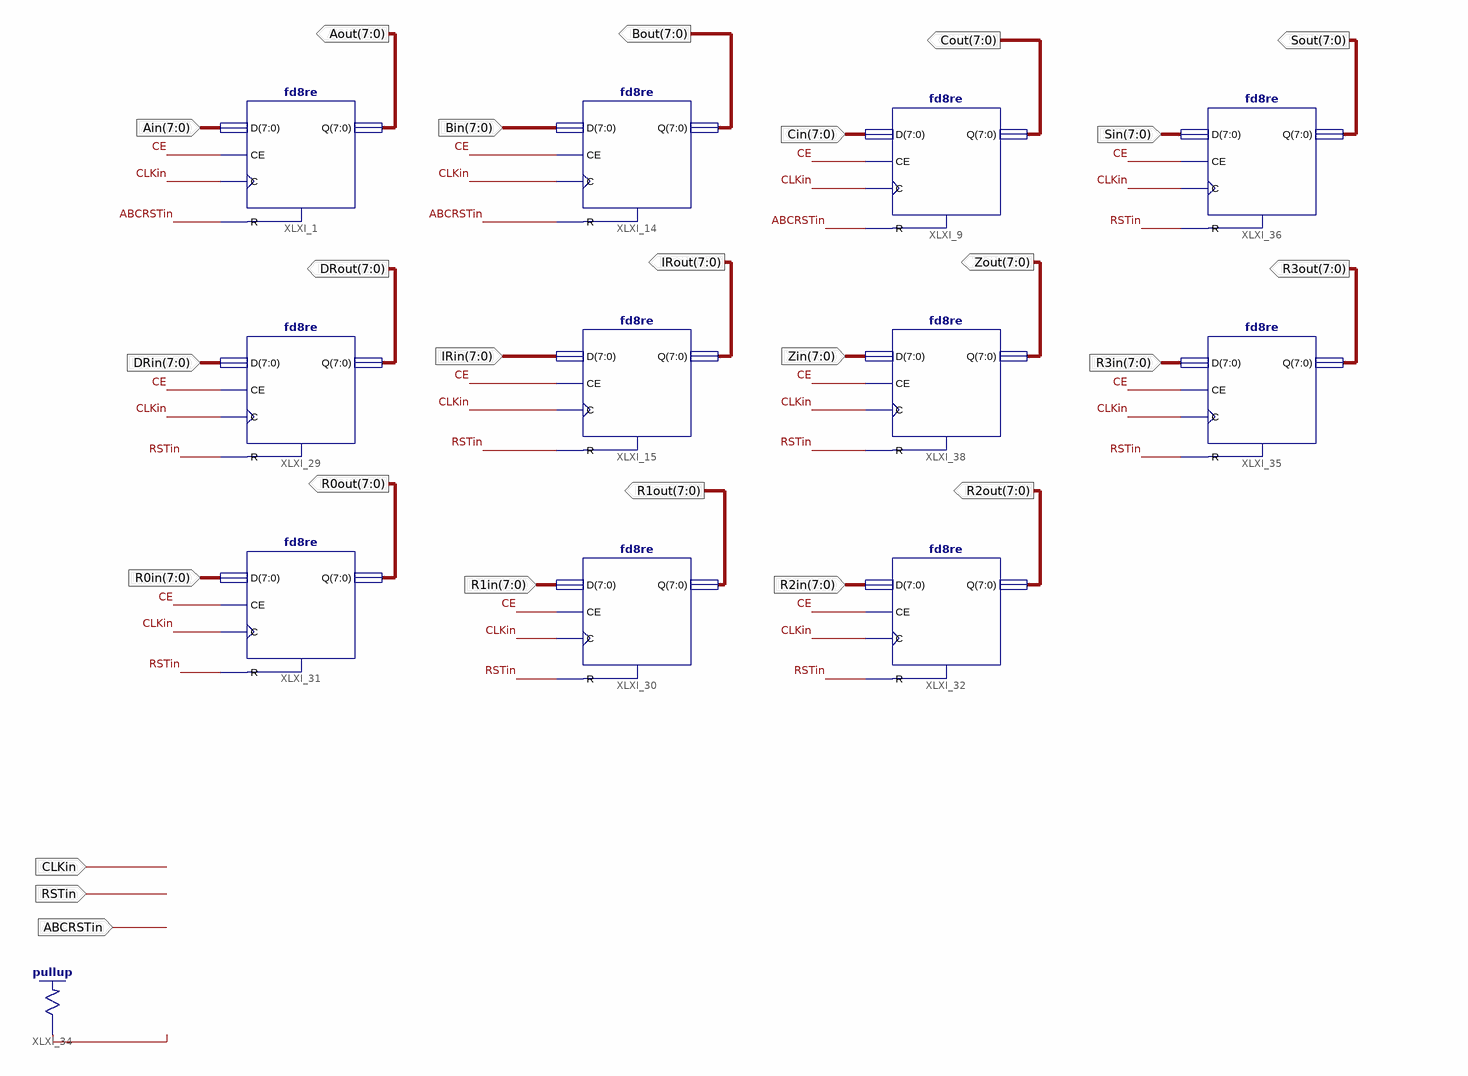
[diagram p0: schematic sheet 1]
// Xilinx ISE schematic RegisterBank.sch (spartan3e) as structural Verilog: 12 symbols, 25 ports
module RegisterBank (
  input  CLKin,
  input  ABCRSTin,
  input  RSTin,
  input  [7:0] R0in,
  input  [7:0] DRin,
  input  [7:0] Ain,
  input  [7:0] R1in,
  input  [7:0] Bin,
  input  [7:0] IRin,
  input  [7:0] Zin,
  input  [7:0] Cin,
  input  [7:0] R2in,
  input  [7:0] R3in,
  input  [7:0] Sin,
  output [7:0] R0out,
  output [7:0] DRout,
  output [7:0] Aout,
  output [7:0] R1out,
  output [7:0] Bout,
  output [7:0] IRout,
  output [7:0] Zout,
  output [7:0] Cout,
  output [7:0] R2out,
  output [7:0] R3out,
  output [7:0] Sout
);

  wire CE, XLXN_66;

  \pullup  XLXI_34 (.O(XLXN_66));
  fd8re XLXI_31 (.C(CLKin), .CE(CE), .D(R0in), .R(RSTin), .Q(R0out));
  fd8re XLXI_29 (.C(CLKin), .CE(CE), .D(DRin), .R(RSTin), .Q(DRout));
  fd8re XLXI_1 (.C(CLKin), .CE(CE), .D(Ain), .R(ABCRSTin), .Q(Aout));
  fd8re XLXI_30 (.C(CLKin), .CE(CE), .D(R1in), .R(RSTin), .Q(R1out));
  fd8re XLXI_14 (.C(CLKin), .CE(CE), .D(Bin), .R(ABCRSTin), .Q(Bout));
  fd8re XLXI_15 (.C(CLKin), .CE(CE), .D(IRin), .R(RSTin), .Q(IRout));
  fd8re XLXI_38 (.C(CLKin), .CE(CE), .D(Zin), .R(RSTin), .Q(Zout));
  fd8re XLXI_9 (.C(CLKin), .CE(CE), .D(Cin), .R(ABCRSTin), .Q(Cout));
  fd8re XLXI_32 (.C(CLKin), .CE(CE), .D(R2in), .R(RSTin), .Q(R2out));
  fd8re XLXI_35 (.C(CLKin), .CE(CE), .D(R3in), .R(RSTin), .Q(R3out));
  fd8re XLXI_36 (.C(CLKin), .CE(CE), .D(Sin), .R(RSTin), .Q(Sout));
endmodule
